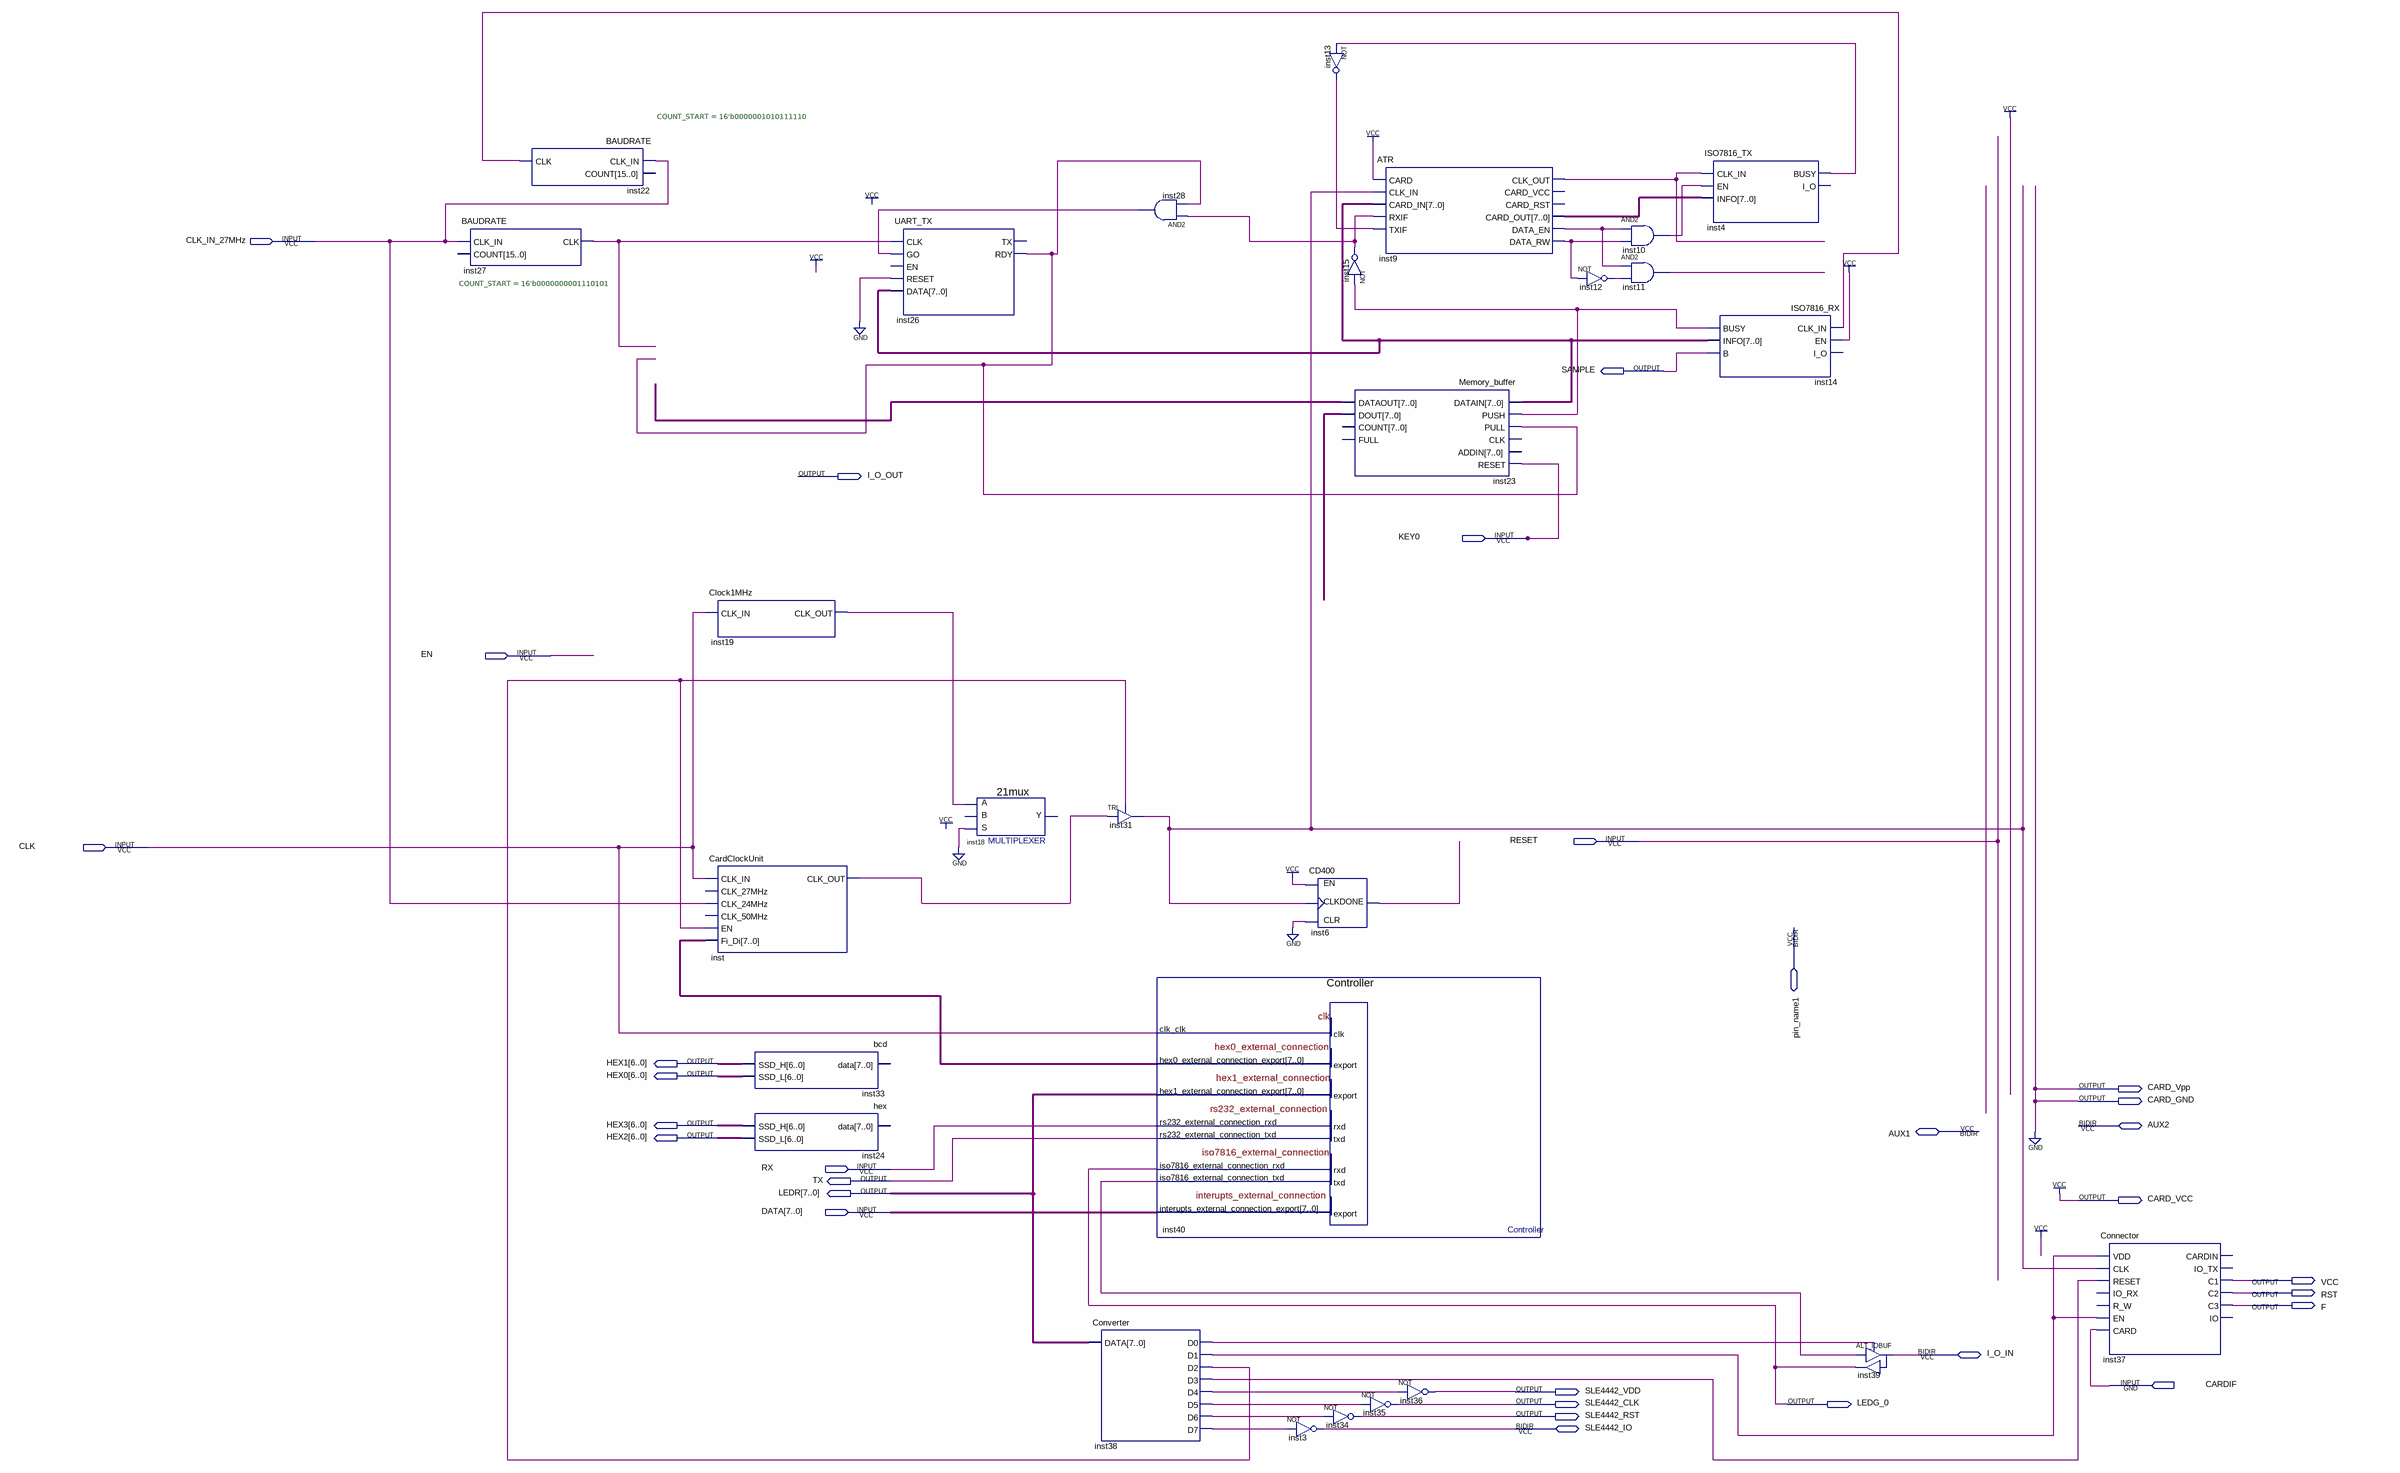
[diagram p0: schematic sheet]
// Quartus schematic Terminal.bdf as structural Verilog: 28 symbols, 31 pins
module Terminal (
  input  CLK_IN_27MHz,
  input  KEY0,
  input  EN,
  input  RESET,
  input  CLK,
  input  RX,
  input  [7:0] DATA,
  input  CARDIF,
  inout  pin_name1,
  inout  AUX2,
  inout  AUX1,
  inout  I_O_IN,
  inout  SLE4442_IO,
  output SAMPLE,
  output I_O_OUT,
  output [6:0] HEX1,
  output [6:0] HEX0,
  output CARD_Vpp,
  output CARD_GND,
  output [6:0] HEX3,
  output [6:0] HEX2,
  output TX,
  output [7:0] LEDR,
  output CARD_VCC,
  output VCC,
  output RST,
  output F,
  output SLE4442_VDD,
  output SLE4442_CLK,
  output LEDG_0,
  output SLE4442_RST
);

  wire inst4_busy, inst6_done, inst9_clk_out, inst9_data_en, inst9_data_rw, inst10_out, inst11_out,
       inst12_out, inst13_out, inst14_busy, inst15_out, inst19_clk_out, inst22_clk, inst26_rdy, inst27_clk,
       inst28_out, inst31_out, inst38_d0, inst38_d1, inst38_d2, inst38_d3, inst38_d4, inst38_d5, inst38_d6,
       inst38_d7, inst40_iso7816_external_connection_txd, inst_clk_out;
  wire [7:0] inst9_card_out, inst14_info, inst23_dataout, inst23_dout, inst40_hex0_external_connection_export;

  BAUDRATE #(.COUNT_START(16'b0000000001110101)) inst27 (.CLK_IN(CLK_IN_27MHz), .CLK(inst27_clk));  // open: COUNT
  BAUDRATE #(.COUNT_START(16'b0000001010111110)) inst22 (.CLK_IN(CLK_IN_27MHz), .CLK(inst22_clk));  // open: COUNT
  Clock1MHz inst19 (.CLK_IN(CLK), .CLK_OUT(inst19_clk_out));
  CardClockUnit inst (
    .CLK_IN(CLK), .CLK_24MHz(CLK_IN_27MHz), .EN(inst38_d2), .Fi_Di(inst40_hex0_external_connection_export),
    .CLK_OUT(inst_clk_out));  // open: CLK_27MHz, CLK_50MHz
  bcd inst33 (.SSD_H(HEX1), .SSD_L(HEX0));  // open: data
  hex inst24 (.SSD_H(HEX3), .SSD_L(HEX2));  // open: data
  UART_TX inst26 (
    .CLK(inst27_clk), .GO(inst28_out), .RESET(1'b0), .DATA(inst14_info), .RDY(inst26_rdy));  // open: EN, TX
  \21mux  inst18 (.S(1'b0), .A(inst19_clk_out));  // open: B, Y
  TRI inst31 (.IN(inst_clk_out), .OE(inst38_d2), .OUT(inst31_out));
  Converter inst38 (
    .DATA(LEDR), .D0(inst38_d0), .D1(inst38_d1), .D2(inst38_d2), .D3(inst38_d3), .D4(inst38_d4),
    .D5(inst38_d5), .D6(inst38_d6), .D7(inst38_d7));
  and inst28 (inst28_out, inst15_out, inst26_rdy);
  Controller inst40 (
    .clk_clk(CLK), .rs232_external_connection_rxd(RX), .iso7816_external_connection_rxd(LEDG_0),
    .interupts_external_connection_export(DATA),
    .hex0_external_connection_export(inst40_hex0_external_connection_export),
    .hex1_external_connection_export(LEDR), .rs232_external_connection_txd(TX),
    .iso7816_external_connection_txd(inst40_iso7816_external_connection_txd));
  CD400 inst6 (.CLR(1'b0), .EN(1'b1), .CLK(inst31_out), .DONE(inst6_done));
  not inst3 (SLE4442_IO, inst38_d7);
  not inst13 (inst13_out, inst4_busy);
  not inst15 (inst15_out, inst14_busy);
  Memory_buffer inst23 (
    .DATAIN(inst14_info), .PUSH(inst14_busy), .PULL(inst26_rdy), .RESET(KEY0), .DATAOUT(inst23_dataout),
    .DOUT(inst23_dout));  // open: CLK, ADDIN, COUNT, FULL
  not inst35 (SLE4442_CLK, inst38_d5);
  not inst34 (SLE4442_RST, inst38_d6);
  ATR inst9 (
    .CARD(1'b1), .CLK_IN(inst31_out), .CARD_IN(inst14_info), .RXIF(inst15_out), .TXIF(inst13_out),
    .CLK_OUT(inst9_clk_out), .CARD_OUT(inst9_card_out), .DATA_EN(inst9_data_en), .DATA_RW(inst9_data_rw));  // open: CARD_VCC, CARD_RST
  not inst36 (SLE4442_VDD, inst38_d4);
  not inst12 (inst12_out, inst9_data_rw);
  and inst10 (inst10_out, inst9_data_en, inst9_data_rw);
  and inst11 (inst11_out, inst9_data_en, inst12_out);
  ISO7816_TX inst4 (.CLK_IN(inst9_clk_out), .EN(inst10_out), .INFO(inst9_card_out), .BUSY(inst4_busy));  // open: I_O
  ISO7816_RX inst14 (.CLK_IN(inst22_clk), .EN(1'b1), .BUSY(inst14_busy), .INFO(inst14_info), .B(SAMPLE));  // open: I_O
  ALT_IOBUF inst39 (.i(inst40_iso7816_external_connection_txd), .oe(inst38_d0), .o(LEDG_0), .io(I_O_IN));
  Connector inst37 (
    .VDD(inst38_d1), .CLK(inst31_out), .RESET(inst38_d3), .EN(inst38_d1), .CARD(CARDIF), .C1(VCC), .C2(RST),
    .C3(F));  // open: IO_RX, R_W, CARDIN, IO_TX, IO

  assign CARD_GND = 1'b0;
  assign CARD_VCC = 1'b1;
  assign CARD_Vpp = 1'b0;
endmodule
